# EAGLE design vcfvca (EAGLE 9.5.2)
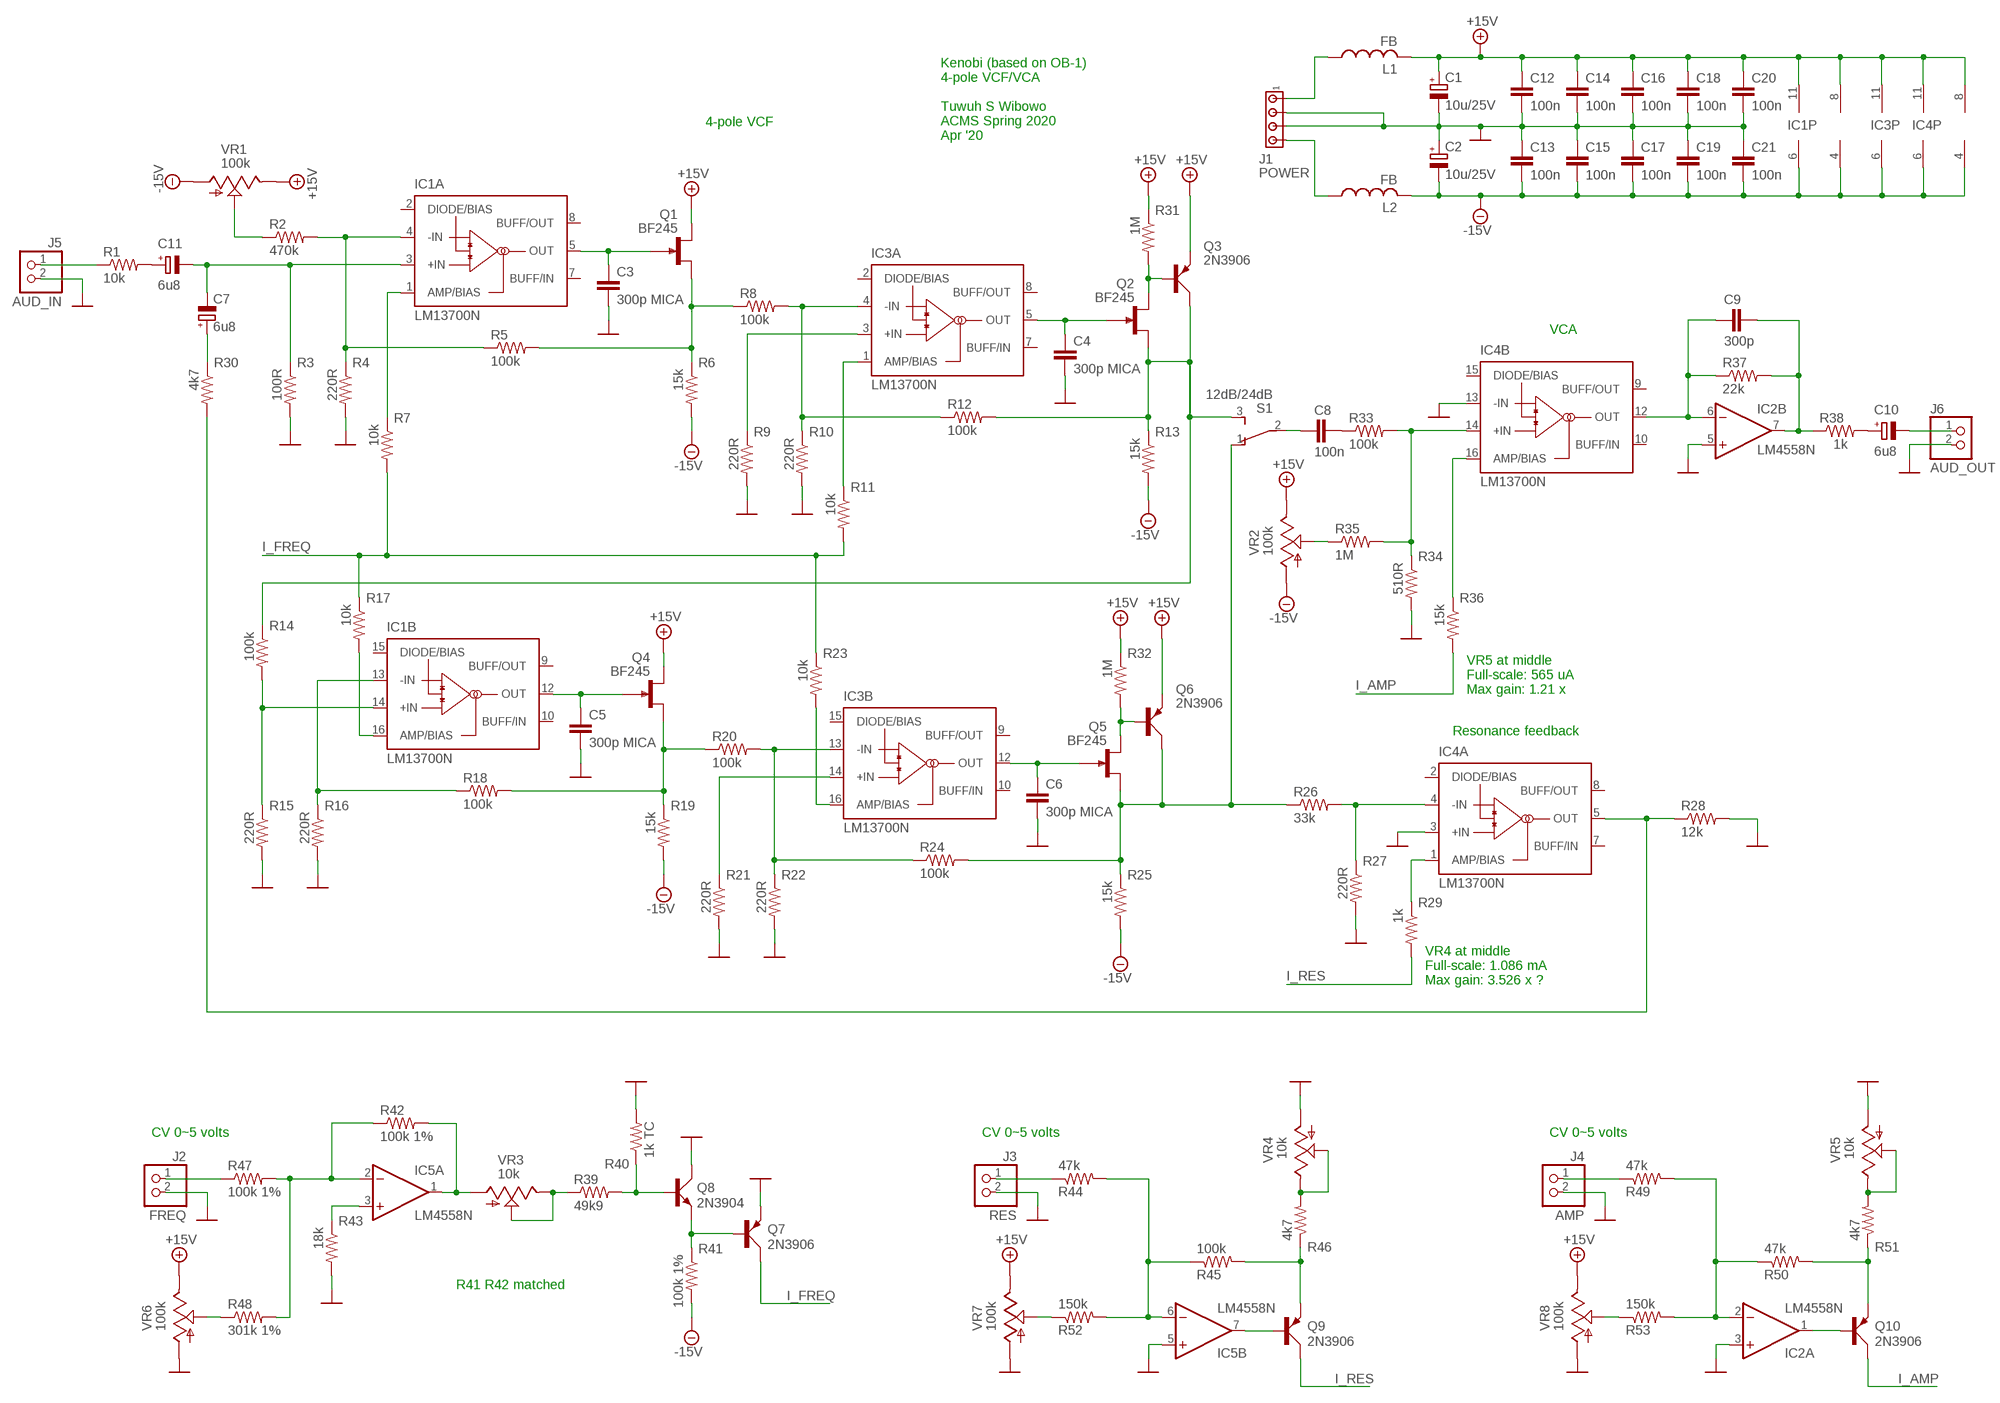
[diagram p0: schematic, sheet 1]

## Parts
C1  10u/25V  CPOL-EUE1.8-4  [E1,8-4]
C2  10u/25V  CPOL-EUE1.8-4  [E1,8-4]
C3  300p MICA  C-EU050-025X075  [C050-025X075]
C4  300p MICA  C-EU050-025X075  [C050-025X075]
C5  300p MICA  C-EU050-025X075  [C050-025X075]
C6  300p MICA  C-EU050-025X075  [C050-025X075]
C7  6u8  CPOL-EUE1.8-4  [E1,8-4]
C8  100n  C-EU050-025X075  [C050-025X075]
C9  300p  C-EU050-025X075  [C050-025X075]
C10  6u8  CPOL-EUE1.8-4  [E1,8-4]
C11  6u8  CPOL-EUE1.8-4  [E1,8-4]
C12  100n  C-EU050-025X075  [C050-025X075]
C13  100n  C-EU050-025X075  [C050-025X075]
C14  100n  C-EU050-025X075  [C050-025X075]
C15  100n  C-EU050-025X075  [C050-025X075]
C16  100n  C-EU050-025X075  [C050-025X075]
C17  100n  C-EU050-025X075  [C050-025X075]
C18  100n  C-EU050-025X075  [C050-025X075]
C19  100n  C-EU050-025X075  [C050-025X075]
C20  100n  C-EU050-025X075  [C050-025X075]
C21  100n  C-EU050-025X075  [C050-025X075]
IC1  LM13700N  LM13600N  [DIL16]
IC2  LM4558N  [DIL08]
IC3  LM13700N  LM13600N  [DIL16]
IC4  LM13700N  LM13600N  [DIL16]
IC5  LM4558N  [DIL08]
J1  POWER  MTA04-156  [1X4MTA]
J2  FREQ  PINHD-1X2  [1X02]
J3  RES  PINHD-1X2  [1X02]
J4  AMP  PINHD-1X2  [1X02]
J5  AUD_IN  PINHD-1X2  [1X02]
J6  AUD_OUT  PINHD-1X2  [1X02]
L1  FB  L-US0207/10  [0207/10]
L2  FB  L-US0207/10  [0207/10]
Q1  BF245  [SOT54C]
Q2  BF245  [SOT54C]
Q3  2N3906  [TO92D]
Q4  BF245  [SOT54C]
Q5  BF245  [SOT54C]
Q6  2N3906  [TO92D]
Q7  2N3906  [TO92D]
Q8  2N3904  [TO92D]
Q9  2N3906  [TO92D]
Q10  2N3906  [TO92D]
R1  10k  R-US_0207/10  [0207/10]
R2  470k  R-US_0207/10  [0207/10]
R3  100R  R-US_0207/10  [0207/10]
R4  220R  R-US_0207/10  [0207/10]
R5  100k  R-US_0207/10  [0207/10]
R6  15k  R-US_0207/10  [0207/10]
R7  10k  R-US_0207/10  [0207/10]
R8  100k  R-US_0207/10  [0207/10]
R9  220R  R-US_0207/10  [0207/10]
R10  220R  R-US_0207/10  [0207/10]
R11  10k  R-US_0207/10  [0207/10]
R12  100k  R-US_0207/10  [0207/10]
R13  15k  R-US_0207/10  [0207/10]
R14  100k  R-US_0207/10  [0207/10]
R15  220R  R-US_0207/10  [0207/10]
R16  220R  R-US_0207/10  [0207/10]
R17  10k  R-US_0207/10  [0207/10]
R18  100k  R-US_0207/10  [0207/10]
R19  15k  R-US_0207/10  [0207/10]
R20  100k  R-US_0207/10  [0207/10]
R21  220R  R-US_0207/10  [0207/10]
R22  220R  R-US_0207/10  [0207/10]
R23  10k  R-US_0207/10  [0207/10]
R24  100k  R-US_0207/10  [0207/10]
R25  15k  R-US_0207/10  [0207/10]
R26  33k  R-US_0207/10  [0207/10]
R27  220R  R-US_0207/10  [0207/10]
R28  12k  R-US_0207/10  [0207/10]
R29  1k  R-US_0207/10  [0207/10]
R30  4k7  R-US_0207/10  [0207/10]
R31  1M  R-US_0207/10  [0207/10]
R32  1M  R-US_0207/10  [0207/10]
R33  100k  R-US_0207/10  [0207/10]
R34  510R  R-US_0207/10  [0207/10]
R35  1M  R-US_0207/10  [0207/10]
R36  15k  R-US_0207/10  [0207/10]
R37  22k  R-US_0207/10  [0207/10]
R38  1k  R-US_0207/10  [0207/10]
R39  49k9  R-US_0207/10  [0207/10]
R40  1k TC  R-US_0207/10  [0207/10]
R41  100k 1%  R-US_0207/10  [0207/10]
R42  100k 1%  R-US_0207/10  [0207/10]
R43  18k  R-US_0207/10  [0207/10]
R44  47k  R-US_0207/10  [0207/10]
R45  100k  R-US_0207/10  [0207/10]
R46  4k7  R-US_0207/10  [0207/10]
R47  100k 1%  R-US_0207/10  [0207/10]
R48  301k 1%  R-US_0207/10  [0207/10]
R49  47k  R-US_0207/10  [0207/10]
R50  47k  R-US_0207/10  [0207/10]
R51  4k7  R-US_0207/10  [0207/10]
R52  150k  R-US_0207/10  [0207/10]
R53  150k  R-US_0207/10  [0207/10]
S1  12dB/24dB  TL36PO  [TL3XPO]
VR1  100k  TRIM_US-S63P  [S63P]
VR2  100k  TRIM_US-S63P  [S63P]
VR3  10k  TRIM_US-S63P  [S63P]
VR4  10k  TRIM_US-S63P  [S63P]
VR5  10k  TRIM_US-S63P  [S63P]
VR6  100k  TRIM_US-B64Y  [B64Y]
VR7  100k  TRIM_US-B64Y  [B64Y]
VR8  100k  TRIM_US-B64Y  [B64Y]

## Nets
+15V: C1.+ C12.1 C14.1 C16.1 C18.1 C20.1 IC1.11(P:V+) IC2.8(P:V+) IC3.11(P:V+) IC4.11(P:V+) IC5.8(P:V+) L1.2 Q1.D Q3.E Q4.D Q6.E R31.1 R32.1 VR1.E VR2.E VR6.E VR7.E VR8.E
-15V: C2.- C13.2 C15.2 C17.2 C19.2 C21.2 IC1.6(P:V-) IC2.4(P:V-) IC3.6(P:V-) IC4.6(P:V-) IC5.4(P:V-) L2.2 R6.2 R13.2 R19.2 R25.2 R41.2 VR1.A VR2.A
GND: C1.- C2.+ C3.2 C4.2 C5.2 C6.2 C12.2 C13.1 C14.2 C15.1 C16.2 C17.1 C18.2 C19.1 C20.2 C21.1 IC2.3(A:+IN) IC2.5(B:+IN) IC4.3(A:+IN) IC4.13(B:-IN) IC5.5(B:+IN) J1.2 J1.3 J2.2 J3.2 J4.2 J5.2 J6.2 Q7.E Q8.C R3.2 R4.2 R9.2 R10.2 R15.2 R16.2 R21.2 R22.2 R27.2 R28.2 R34.2 R40.2 R43.2 VR4.A VR5.A VR6.A VR7.A VR8.A
I_AMP: Q10.C R36.2
I_FREQ: Q7.C R7.2 R11.2 R17.1 R23.1
I_RES: Q9.C R29.2
N$2: C4.1 IC3.5(A:OUT) Q2.G
N$3: C3.1 IC1.5(A:OUT) Q1.G
N$4: C5.1 IC1.12(B:OUT) Q4.G
N$5: C6.1 IC3.12(B:OUT) Q5.G
N$6: IC1.4(A:-IN) R2.2 R4.1 R5.1
N$7: IC1.1(A:AMP/BIAS) R7.1
N$8: Q1.S R5.2 R6.1 R8.1
N$9: C7.- C11.- IC1.3(A:+IN) R3.1
N$10: IC3.1(A:AMP/BIAS) R11.1
N$11: IC3.3(A:+IN) R9.1
N$12: IC3.4(A:-IN) R8.2 R10.1 R12.1
N$13: C7.+ R30.1
N$14: IC1.14(B:+IN) R14.2 R15.1
N$15: IC1.13(B:-IN) R16.1 R18.1
N$16: IC4.4(A:-IN) R26.2 R27.1
N$17: Q4.S R18.2 R19.1 R20.1
N$18: Q2.S Q3.C R12.2 R13.1 R14.1 S1.3(S)
N$19: Q5.S Q6.C R24.2 R25.1 R26.1 S1.1(O)
N$20: IC3.13(B:-IN) R20.2 R22.1 R24.1
N$21: IC3.14(B:+IN) R21.1
N$22: IC4.1(A:AMP/BIAS) R29.1
N$23: IC1.16(B:AMP/BIAS) R17.2
N$24: IC3.16(B:AMP/BIAS) R23.2
N$25: IC4.5(A:OUT) R28.1 R30.2
N$26: Q5.D Q6.B R32.2
N$27: Q2.D Q3.B R31.2
N$28: C8.1 S1.2(P)
N$29: C8.2 R33.1
N$30: IC4.14(B:+IN) R33.2 R34.1 R35.2
N$31: C9.1 IC2.6(B:-IN) IC4.12(B:OUT) R37.1
N$32: R35.1 VR2.S
N$33: IC4.16(B:AMP/BIAS) R36.1
N$34: R2.1 VR1.S
N$35: C9.2 IC2.7(B:OUT) R37.2 R38.1
N$36: C10.+ R38.2
N$37: C11.+ R1.2
N$38: IC5.1(A:OUT) R42.2 VR3.A
N$39: R39.1 VR3.E VR3.S
N$40: Q8.B R39.2 R40.1
N$41: IC5.3(A:+IN) R43.1
N$42: IC5.2(A:-IN) R42.1 R47.2 R48.2
N$43: Q7.B Q8.E R41.1
N$44: R46.2 VR4.E VR4.S
N$45: R51.2 VR5.E VR5.S
N$46: Q9.E R45.2 R46.1
N$47: IC5.7(B:OUT) Q9.B
N$48: IC5.6(B:-IN) R44.2 R45.1 R52.2
N$49: Q10.E R50.2 R51.1
N$50: IC2.1(A:OUT) Q10.B
N$51: J2.1 R47.1
N$52: IC2.2(A:-IN) R49.2 R50.1 R53.2
N$53: J4.1 R49.1
N$54: R48.1 VR6.S
N$55: J5.1 R1.1
N$56: J3.1 R44.1
N$57: C10.- J6.1
N$58: R52.1 VR7.S
N$60: R53.1 VR8.S
N$63: J1.1 L1.1
N$64: J1.4 L2.1
Unconnected: IC1.2(A:DIODE/BIAS) IC1.7(A:BUFF/IN) IC1.8(A:BUFF/OUT) IC1.9(B:BUFF/OUT) IC1.10(B:BUFF/IN) IC1.15(B:DIODE/BIAS) IC3.2(A:DIODE/BIAS) IC3.7(A:BUFF/IN) IC3.8(A:BUFF/OUT) IC3.9(B:BUFF/OUT) IC3.10(B:BUFF/IN) IC3.15(B:DIODE/BIAS) IC4.2(A:DIODE/BIAS) IC4.7(A:BUFF/IN) IC4.8(A:BUFF/OUT) IC4.9(B:BUFF/OUT) IC4.10(B:BUFF/IN) IC4.15(B:DIODE/BIAS)

## Notes on the sheet
- 4-pole VCF
- Kenobi (based on OB-1)
  4-pole VCF/VCA
  
  Tuwuh S Wibowo
  ACMS Spring 2020
  Apr '20
- VCA
- VR5 at middle
  Full-scale: 565 uA
  Max gain: 1.21 x
- Resonance feedback
- VR4 at middle
  Full-scale: 1.086 mA
  Max gain: 3.526 x ?
- CV 0~5 volts | CV 0~5 volts | CV 0~5 volts
- R41 R42 matched

## Library data of the parts
C1 C2 C7 C10 C11 = rcl:CPOL-EU: POLARIZED CAPACITOR, European symbol; SPICEPREFIX: C
C3-C6 C8 C9 C12-C21 = rcl:C-EU: CAPACITOR, European symbol; SPICEPREFIX: C
IC1 IC3 IC4 = national-semiconductor:LM13600: Dual Operational Transconductance Amplifiers with Linearizing Diodes and Buffers Source: lm13600.PDF
IC2 IC5 = linear:*4558: OP AMP
J1 = con-amp:MTA04-156: AMP connector
J2-J6 = pinhead:PINHD-1X2: PIN HEADER
L1 L2 = rcl:L-US: INDUCTOR, American symbol; SPICEPREFIX: L
Q1 Q2 Q4 Q5 = transistor-small-signal:BF245: N-CHANNEL FET http://www.onsemi.com/pub/Collateral/BF245A-D.PDF
Q3 Q6 Q7 Q9 Q10 = transistor-small-signal:2N3906: PNP TRANSISTOR
Q8 = transistor-small-signal:2N3904: NPN TRANSISTOR
R1-R53 = rcl:R-US_: RESISTOR, American symbol; SPICEPREFIX: R
S1 = switch:TL36PO: TINY SWITCH ON - ON Source: http://www2.produktinfo.conrad.com/datenblaetter/700000-724999/705152-da-01-de-Subminiaturschalter_TL_36YO.pdf
VR1-VR8 = pot:TRIM_US-: POTENTIOMETER

## Board
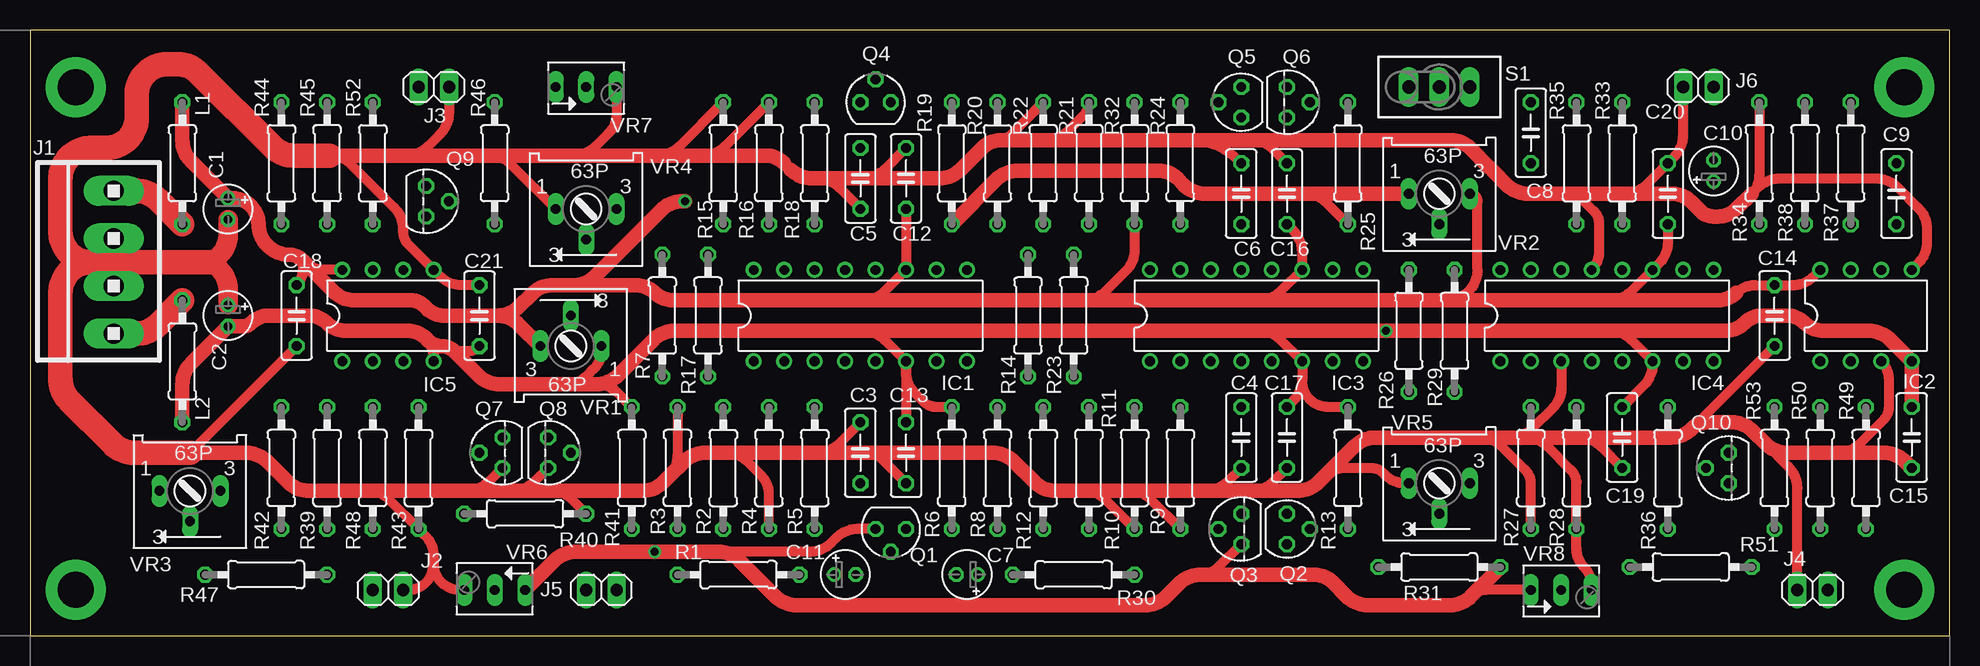
[diagram p1: board, top side]
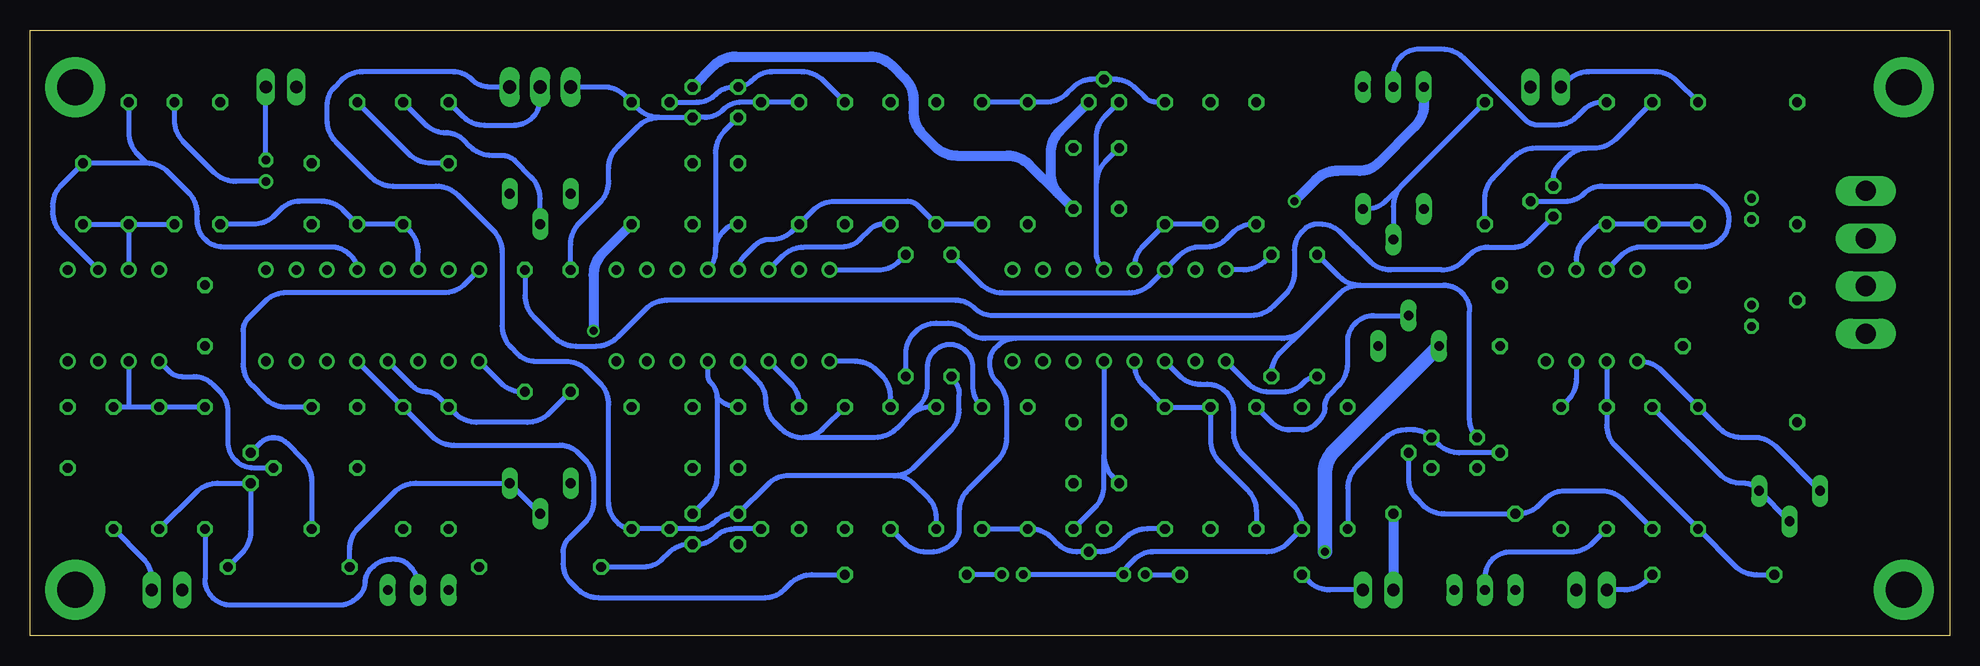
[diagram p2: board, bottom side, seen from below]

Size 160 x 50.47 mm. Coordinates in mm from the lower left corner, seen from the top.
Outline: 0,0 160,0 160,50.47 0,50.47 0,0
Copper layers (1*16): Top 0.035mm / dielectric 1.5mm / Bottom 0.035mm
Design rules "default": minimum track width 6mil, minimum drill 0.35mm, track to track 6mil, track to pad 6mil, pad to pad 6mil, via to via 6mil, smd to smd 6mil, copper to edge 40mil, drill to drill 6mil, minimum pad ring 10mil, minimum via ring 8mil, stop-mask expansion 4mil, vias tented up to drill 0mil, thermal gap 10mil

### Footprints (pad centres in the part's own frame; a part is rotated, then mirrored left to right if it is on the bottom)
E1,8-4 = drill 0.711 pad 1.168: + -0.889,0 | drill 0.711 pad 1.168 octagon: - 0.889,0
C050-025X075 = drill 0.813 octagon: 1 -2.54,0; 2 2.54,0
DIL16 = drill 0.813 pad 1.27: 1 -8.89,-3.81; 2 -6.35,-3.81; 3 -3.81,-3.81; 4 -1.27,-3.81; 5 1.27,-3.81; 6 3.81,-3.81; 7 6.35,-3.81; 8 8.89,-3.81; 9 8.89,3.81; 10 6.35,3.81; 11 3.81,3.81; 12 1.27,3.81; 13 -1.27,3.81; 14 -3.81,3.81; 15 -6.35,3.81; 16 -8.89,3.81
DIL08 = drill 0.813 pad 1.27: 1 -3.81,-3.81; 2 -1.27,-3.81; 3 1.27,-3.81; 4 3.81,-3.81; 5 3.81,3.81; 6 1.27,3.81; 7 -1.27,3.81; 8 -3.81,3.81
1X4MTA = drill 1.676 long: 1 5.944,0; 2 1.981,0; 3 -1.981,0; 4 -5.944,0
1X02 = drill 1.016 long: 1 -1.27,0; 2 1.27,0
0207/10 = drill 0.813 octagon: 1 -5.08,0; 2 5.08,0
SOT54C = drill 0.813 octagon: D 1.27,0; G -1.27,0; S 0,1.905
TO92D = drill 0.813 octagon: B 0,1.905; C 1.27,0; E -1.27,0
TL3XPO = drill 1.1 pad 1.422 long: 1 -2.54,0; 2 0,0; 3 2.54,0
S63P = drill 0.813 long: A 2.54,0; E -2.54,0; S 0,2.54
B64Y = drill 0.813 long: A 2.54,0; E -2.54,0; S 0,0

### Placement (x,y rotation side)
C1  16.51,35.56 270 top
C2  16.51,26.67 270 top
C3  69.22,15.24 90 top
C4  100.97,16.51 270 top
C5  69.22,38.1 270 top
C6  100.97,36.83 90 top
C7  78.11,5.08 180 top
C8  125.09,41.91 270 top
C9  155.57,36.83 270 top
C10  140.34,38.73 90 top
C11  67.94,5.08 0 top
C12  73.03,38.1 90 top
C13  73.03,15.24 90 top
C14  145.41,26.67 270 top
C15  156.84,16.51 90 top
C16  104.78,36.83 90 top
C17  104.78,16.51 90 top
C18  22.23,26.67 270 top
C19  132.72,16.51 90 top
C20  136.53,36.83 90 top
C21  37.47,26.67 270 top
IC1  69.22,26.67 0 top
IC2  153.03,26.67 0 top
IC3  102.23,26.67 0 top
IC4  131.44,26.67 0 top
IC5  29.84,26.67 0 top
J1  6.99,31.11 90 top
J2  29.84,3.81 0 top
J3  33.66,45.72 0 top
J4  148.59,3.81 180 top
J5  47.62,3.81 180 top
J6  139.06,45.72 180 top
L1  12.7,39.37 90 top
L2  12.7,22.86 270 top
Q1  71.75,8.89 180 top
Q2  104.78,8.89 270 top
Q3  100.97,8.89 90 top
Q4  70.48,44.45 0 top
Q5  100.97,44.45 90 top
Q6  104.78,44.45 270 top
Q7  39.37,15.24 90 top
Q8  43.18,15.24 270 top
Q9  33.02,36.2 270 top
Q10  141.6,13.97 90 top
R1  59.05,5.08 0 top
R2  57.78,13.97 270 top
R3  53.98,13.97 90 top
R4  61.59,13.97 270 top
R5  65.41,13.97 270 top
R6  76.83,13.97 90 top
R7  52.7,26.67 90 top
R8  80.64,13.97 90 top
R9  95.89,13.97 270 top
R10  92.08,13.97 270 top
R11  88.27,13.97 270 top
R12  84.45,13.97 270 top
R13  109.86,13.97 90 top
R14  83.19,26.67 90 top
R15  57.78,39.37 90 top
R16  61.59,39.37 90 top
R17  56.52,26.67 90 top
R18  65.41,39.37 90 top
R19  76.83,39.37 270 top
R20  80.64,39.37 270 top
R21  88.27,39.37 90 top
R22  84.45,39.37 90 top
R23  87,26.67 90 top
R24  95.89,39.37 90 top
R25  109.86,39.37 270 top
R26  114.94,25.4 270 top
R27  125.09,13.97 270 top
R28  128.91,13.97 270 top
R29  118.75,25.4 90 top
R30  87,5.08 0 top
R31  117.47,5.71 180 top
R32  92.08,39.37 90 top
R33  132.72,39.37 270 top
R34  144.15,39.37 90 top
R35  128.91,39.37 270 top
R36  136.53,13.97 270 top
R37  151.76,39.37 270 top
R38  147.96,39.37 90 top
R39  24.77,13.97 270 top
R40  41.27,10.16 0 top
R41  50.16,13.97 90 top
R42  20.95,13.97 90 top
R43  32.38,13.97 270 top
R44  20.95,39.37 270 top
R45  24.77,39.37 90 top
R46  38.73,39.37 90 top
R47  19.68,5.08 180 top
R48  28.57,13.97 90 top
R49  153.03,13.97 90 top
R50  149.22,13.97 270 top
R51  138.43,5.71 180 top
R52  28.57,39.37 270 top
R53  145.41,13.97 90 top
S1  117.47,45.72 0 top
VR1  45.09,24.13 0 top
VR2  117.47,36.83 180 top
VR3  13.34,12.06 180 top
VR4  46.35,35.56 180 top
VR5  117.47,12.7 180 top
VR6  38.73,3.81 180 top
VR7  46.35,45.72 0 top
VR8  127.64,3.81 0 top

### Tracks (layer width: path | path; a pad name or v marks a point on that pad's centre or on a via)
+15V  (via drill 0.65)
  Top 0.813: 69.43,27.94 arc45 71.23,28.68 IC1.11 C12.1 | 102.45,27.94 arc45 104.25,28.68 IC3.11 106.05,31.97 arc45 105.3,33.76 C16.1 | 131.66,27.94 arc45 133.46,28.68 IC4.11 135.78,31.01 arc45 136.53,32.8 C20.1 | R32.1 92.08,32.17 arc-45 91.33,30.37 89.64,28.68 arc-45 87.85,27.94 | 118.11,27.94 arc90 120.65,30.48 120.65,36.2 arc90 VR2.E | 40.75,25.93 arc45 38.95,26.67 | 142.24,28.57 arc-45 143.77,29.21 C14.1 146.9,29.21 arc45 148.7,29.95 IC2.8 | Q1.D 69,8.89 arc45 67.2,8.15 66.78,7.73 arc-45 64.99,6.99 57.37,6.99 | IC5.8 24.55,30.48 arc-45 22.75,31.22 22.75,30.48 arc-45 C18.1 | Q3.E 99.03,5.68 arc-45 97.57,5.08 | VR8.E 121.39,3.81 arc45 120.12,3.28
  Top 1.219: 38.95,26.67 34.55,26.67 arc-45 33.02,27.3 32.83,27.49 arc45 31.75,27.94 27.09,27.94 arc-45 25.29,28.68 22.75,31.22 22.67,31.3 arc45 21.59,31.75 arc-90 19.05,34.29 arc90 16.89,36.45 C1.+ 13.44,39.52 arc-45 12.7,41.31 L1.2 | 38.95,26.67 arc45 40.75,27.41 41.8,28.47 arc-45 43.6,29.21 45.3,29.21 | 142.24,28.57 arc-45 140.71,27.94 131.66,27.94 118.11,27.94 102.45,27.94 87.85,27.94 69.43,27.94 53.6,27.94 arc-45 52.07,28.57 arc45 50.54,29.21 45.3,29.21 | v54.61,36.2 54.39,36.2 arc45 52.6,35.45 47.1,29.95 arc-45 45.3,29.21 | 38.95,26.67 arc-45 40.75,25.93 VR1.E | VR6.E 43.71,6.24 arc-45 45.5,6.99 v52.07,6.99 57.37,6.99 arc-45 59.16,6.24 62.12,3.28 arc45 63.92,2.54 92.93,2.54 arc45 94.72,3.28 95.78,4.34 arc-45 97.57,5.08 107.05,5.08 arc-45 108.58,4.45 109.75,3.28 arc45 111.54,2.54 118.33,2.54 arc45 120.12,3.28 R31.1
  Bottom 0.813: VR7.E 43.81,44.23 arc45 44.56,42.44 47.62,39.37 arc45 49.16,38.73 51.02,38.73 arc-45 52.81,37.99 v54.61,36.2 | Q4.D 74.19,42.02 arc-45 74.93,40.22 74.93,38.52 arc-45 74.19,36.72 | C12.1 74.19,36.72 | 74.19,36.72 76.73,39.26 arc-45 78.52,40.01 82.77,40.01 arc45 84.56,40.75 85.62,41.8 arc45 86.36,43.6 86.36,44.67 arc-45 87.1,46.46 88.16,47.52 arc-45 89.95,48.26 101.18,48.26 arc-45 102.98,47.52 Q6.E | 51.33,15.35 arc-45 52.07,13.55
  Bottom 1.219: VR1.E 51.33,15.35 arc-45 52.07,13.55 v52.07,6.99
-15V  (via drill 0.65)
  Top 0.813: 141.34,25.4 arc45 142.88,26.04 arc-45 144.41,26.67 | 146.42,26.67 arc-45 147.96,26.04 arc45 149.49,25.4 | IC1.6 71.23,24.66 arc45 69.43,25.4 | 102.45,25.4 arc-45 104.25,24.66 IC3.6 106.05,21.37 | 106.05,21.37 arc-45 105.3,19.58 C17.2 | IC1.6 C13.2 | 131.66,25.4 arc-45 133.46,24.66 IC4.6 135.25,22.64 arc-45 134.51,20.85 C19.2 | 155.05,24.66 arc45 153.25,25.4 | 80.54,37.99 arc-45 82.33,38.73 | 106.26,36.83 arc-45 108.06,36.09 R25.2 | R6.2 75.56,19.05 arc-45 74.48,19.5 73.77,20.21 arc-45 73.03,22.01 IC1.6 | R13.2 108.21,19.05 arc-45 106.68,19.68 arc-45 106.05,21.22 106.05,21.37 | R41.2 49,20.21 arc45 47.21,20.95 | IC5.4 33.66,23.23 arc45 33.02,24.77 | VR1.A 47.62,23.76 arc-45 46.99,22.23 46.46,21.7 arc-45 44.67,20.95 43.18,20.95 | C21.2 arc-45 36.38,23.68 35.37,23.68
  Top 1.219: R19.2 80.54,37.99 arc-45 82.33,38.73 94.1,38.73 arc-45 95.63,38.1 96.16,37.57 arc45 97.95,36.83 106.26,36.83 VR2.A | C15.2 IC2.4 155.05,24.66 arc45 153.25,25.4 149.49,25.4 arc-45 147.96,26.04 arc45 146.42,26.67 144.41,26.67 arc45 142.88,26.04 arc-45 141.34,25.4 131.66,25.4 v113.03,25.4 102.45,25.4 69.43,25.4 53.76,25.4 arc45 51.96,24.66 49,21.7 arc-45 47.21,20.95 43.18,20.95 39.15,20.95 arc-45 37.36,21.7 35.37,23.68 arc45 34.29,24.13 arc-45 33.21,24.58 33.02,24.77 arc45 31.49,25.4 26.3,25.4 arc-45 24.77,26.04 arc45 23.23,26.67 19.95,26.67 arc45 18.41,26.04 arc-45 17.8,25.78 C2.- 13.44,22.71 arc45 12.7,20.92 L2.2
  Bottom 0.813: R25.2 112.29,31.86 arc-45 113.03,30.06 v113.03,25.4
GND
  Top 0.813: 54.5,14.5 arc-45 56.3,15.24 | 69.85,15.24 arc-45 70.93,14.79 C13.1 | C3.2 67.42,15.98 arc-45 65.62,15.24 | R3.2 53.98,15.02 arc-45 53.23,13.23 | R4.2 61.59,11.8 arc45 60.96,13.34 59.8,14.5 arc45 58,15.24 | 138.54,17.25 arc-45 136.74,16.51 | 138.54,17.25 C14.2 | C19.1 130.92,15.77 arc45 129.12,16.51 | R27.2 125.09,12.7 arc45 124.65,13.78 122.66,15.77 arc45 120.87,16.51 | IC4.3 127.64,20.58 arc-45 127,19.05 125.2,17.25 arc-45 123.41,16.51 124.68,16.51 arc-45 126.47,15.77 128.46,13.78 arc-45 128.91,12.7 R28.2 128.91,7.25 arc45 129.54,5.71 arc-45 130.18,4.18 VR8.A | 139.81,17.78 arc45 138.54,17.25 | 141.6,17.78 141.82,17.78 arc-45 143.62,17.04 | 146.47,15.24 arc-45 144.67,15.98 146.58,14.08 arc-45 147.32,12.28 J4.2 | IC2.3 arc-45 154.94,21.33 154.94,19.05 arc-45 154.49,17.97 152.51,15.98 arc-45 150.71,15.24 | C5.2 67.42,37.36 arc45 65.62,38.1 65.19,38.1 arc-45 63.39,38.84 62.87,39.37 arc45 61.33,40.01 | C12.2 71.23,38.84 arc-45 69.43,38.1 | C6.2 100.7,39.63 arc45 96.74,41.27 | 120.02,40.64 arc45 118.48,41.27 | 121.6,39.05 121.92,38.73 | 123.08,37.57 arc45 124.88,36.83 | VR7.A 48.9,43.44 arc-45 48.26,41.91 47.1,40.75 arc-45 45.3,40.01 | R15.2 54.08,40.75 arc-45 52.29,40.01 | R16.2 57.89,40.75 arc-45 56.1,40.01 | C21.1 35.98,29.21 arc-45 34.18,29.95 IC5.5 31.56,32.57 arc-45 31.11,33.66 31.11,33.87 arc45 30.37,35.67 26.78,39.26 arc45 24.98,40.01 | 132.93,36.83 arc45 134.73,37.57 C20.2 137.05,39.9 arc45 137.79,41.69 J6.2 | IC4.13 arc45 130.81,32.01 130.81,34.29 arc45 130.36,35.37 129.65,36.09 arc45 127.85,36.83 | 52.81,12.81 arc-45 51.02,12.06 | R40.2 45.19,11.32 arc45 43.4,12.06
  Top 0.813: Q8.C 42.02,12.81 arc-45 40.22,12.06 | Q7.E 38.21,12.81 arc-45 36.41,12.06 | J2.2 31.49,3.81 arc45 33.02,4.45 arc45 33.66,5.98 | VR6.A 35.82,3.81 arc-45 34.29,4.45 arc-45 33.66,5.98 | 23.28,12.06 arc-45 21.48,12.81 | VR4.A 40.11,39.26 arc45 38.32,40.01 | 31.33,40.01 arc45 33.13,40.75 34.18,41.8 arc45 34.92,43.6 J3.2 | C16.2 103.61,40.53 arc45 101.82,41.27 | 33.66,5.98 33.66,6.57 arc45 32.91,8.36 R43.2 29.95,11.32 arc45 28.16,12.06 | R21.2 arc-45 87.82,43.37 86.47,42.02 arc-45 84.67,41.27 83.19,41.27 | R22.2 83.71,43.71 | 83.71,43.71 arc-45 83.71,43.71 | 80.91,41.27 arc45 81.54,41.54 83.71,43.71 | C18.2 13.34,15.24 | R10.2 89.64,11.32 arc45 87.85,12.06 85.51,12.06 | R9.2 93.45,11.32 arc45 91.66,12.06 89.53,12.06 | C4.2 99.8,12.81 arc-45 98.01,12.06 93.34,12.06 | C17.1 103.61,12.81 arc-45 101.82,12.06 99.06,12.06 | VR5.A 114.56,12.7 arc-45 113.03,13.34 112.84,13.52 arc45 111.76,13.97 109.64,13.97 arc45 107.84,13.23 107.42,12.81 | R34.2 144.15,38.36 arc-45 143.51,36.83 144.04,37.36 arc-45 145.83,38.1 153.89,38.1 arc-45 155.68,37.36 157.37,35.67 arc-45 158.12,33.87 158.12,32.8 arc-45 157.37,31.01 IC2.5
  Top 1.219: 24.98,40.01 31.33,40.01 38.32,40.01 45.3,40.01 52.29,40.01 56.1,40.01 61.33,40.01 arc-45 62.87,39.37 | 63.39,38.84 arc45 65.19,38.1 69.43,38.1 75.78,38.1 arc45 77.58,38.84 79.38,40.64 arc-45 80.91,41.27 83.19,41.27 96.74,41.27 101.82,41.27 118.48,41.27 arc-45 120.02,40.64 121.6,39.05 | 121.92,38.73 123.08,37.57 arc45 124.88,36.83 127.85,36.83 132.93,36.83 136.9,36.83 arc-45 138.43,36.2 139.25,35.37 arc45 140.34,34.92 140.71,34.92 arc45 142.24,35.56 143.51,36.83 | 141.6,17.78 139.81,17.78 arc45 138.54,17.25 arc-45 136.74,16.51 129.12,16.51 123.41,16.51 120.87,16.51 112.18,16.51 arc45 110.38,15.77 107.42,12.81 arc-45 105.63,12.06 99.06,12.06 93.34,12.06 89.53,12.06 85.51,12.06 arc-45 83.71,12.81 82.02,14.5 arc45 80.23,15.24 69.85,15.24 65.62,15.24 58,15.24 56.3,15.24 arc45 54.5,14.5 53.23,13.23 52.81,12.81 arc-45 51.02,12.06 43.4,12.06 40.22,12.06 36.41,12.06 28.16,12.06 23.28,12.06 arc-45 21.48,12.81 19.79,14.5 arc45 18,15.24 13.34,15.24 | 141.82,17.78 arc-45 143.62,17.04 144.67,15.98 arc45 146.47,15.24 150.71,15.24 154.52,15.24 arc-45 156.32,14.5 C15.1
  Top 1.626: C1.- 16.51,33.44 arc-45 15.77,31.64 15.24,31.11 15.77,30.59 arc-45 16.51,28.79 C2.+
  Top 2.032: J1.2 6.99,31.11 | 6.99,31.11 J1.3 | 15.24,31.11 6.99,31.11 | 5.08,31.11 arc-90 2.54,33.66 2.54,38.1 arc-90 5.08,40.64 6.35,40.64 arc90 8.89,43.18 8.89,45.09 arc-90 11.43,47.62 12.28,47.62 arc-45 14.08,46.88 20.21,40.75 arc45 22.01,40.01 24.98,40.01 | 6.99,31.11 5.08,31.11 | 5.08,31.11 arc90 2.54,28.57 2.54,21.37 arc45 3.28,19.58 6.88,15.98 arc45 8.67,15.24 13.34,15.24
  Bottom 0.813: R40.2 J5.2
I_AMP
  Bottom 0.406: Q10.C 140.78,16.06 arc45 139.7,16.51 arc45 138.62,16.06 137.27,14.71 arc45 136.53,12.92 R36.2
I_FREQ
  Bottom 0.406: 53.87,25.51 arc45 55.66,24.77 77.84,24.77 | R17.1 56.52,21.81 arc45 55.77,23.6 53.87,25.51 | Q7.C arc45 40.01,18.04 40.01,27.04 arc-45 40.64,28.57 arc-45 42.17,29.21 49.11,29.21 | R7.2 50.91,29.95 arc-45 49.11,29.21 | 53.87,25.51 50.91,28.47 arc45 49.11,29.21 | 77.84,24.77 arc-45 79.38,24.13 79.56,23.94 arc-45 80.01,22.86 80.01,22.61 arc-45 79.38,21.08 79.36,21.06 arc45 78.61,19.27 78.61,16.42 arc45 79.36,14.62 81.81,12.17 arc-45 82.55,10.38 82.55,8.89 arc45 83,7.81 83.08,7.73 arc45 84.87,6.99 85.31,6.99 arc45 87.1,7.73 R11.2 | 77.84,24.77 80.38,24.77 arc45 81.92,25.4 arc-45 83.45,26.04 84.45,26.04 arc-90 87,23.5 R23.1
I_RES
  Bottom 0.406: Q9.C 35.11,32.83 arc45 36.2,32.38 38.47,32.38 arc-45 40.01,31.75 40.53,31.22 arc45 42.33,30.48 46.57,30.48 arc45 48.37,31.22 50.69,33.55 arc-45 52.49,34.29 52.7,34.29 arc-45 53.79,33.84 53.98,33.66 arc-45 54.61,32.12 54.61,30.26 arc45 55.35,28.47 56.41,27.41 arc45 58.2,26.67 79.75,26.67 arc45 81.28,27.3 arc-45 82.81,27.94 106.9,27.94 arc-45 108.69,27.2 111.02,24.87 arc45 112.81,24.13 114.52,24.13 arc45 116.31,24.87 118,26.56 arc45 118.75,28.36 R29.2
N$1  (via drill 3 pad 5)
  other vias: 3.81,45.72
N$2
  Bottom 0.406: Q2.G 103.49,11.45 arc-45 102.74,13.24 102.74,19.86 | IC3.5 103.5,21.7 arc-45 103.25,21.08 arc45 102.74,19.86 | C4.1 arc45 102.62,19.74 102.74,19.86
N$3
  Bottom 0.406: IC1.5 70.48,15.02 | 70.48,15.02 arc-45 69.74,13.23 C3.1 | Q1.G 71.23,10.69 arc-45 70.48,12.48 70.48,15.02
N$4
  Bottom 0.406: IC1.12 arc45 71.12,32.01 71.12,37.68 | Q4.G 70.38,43.29 arc-45 71.12,41.49 71.12,37.68 | C5.1 70.38,39.48 arc-45 71.12,37.68
N$5
  Bottom 0.406: Q5.G 102.13,42.02 arc-45 102.87,40.22 102.87,32.12 | IC3.12 arc-45 102.87,32.01 102.87,32.12 | C6.1 arc-45 102.05,33.84 102.23,33.66 arc-45 102.87,32.12
N$6
  Bottom 0.406: IC1.4 67.94,22.64 arc-45 67.2,20.85 R5.1 R4.1 61.59,16.29 arc-45 60.85,14.5 58.53,12.17 arc45 57.78,10.38 R2.2
N$7
  Bottom 0.406: IC1.1 58.53,21.06 arc-45 56.73,20.32 55.51,20.32 arc-45 53.98,20.95 53.79,21.14 arc45 R7.1
N$8
  Bottom 0.406: R5.2 66.89,8.89 arc-45 68.69,8.15 69.22,7.62 arc45 70.75,6.99 Q1.S 72.76,6.99 arc45 74.3,7.62 74.82,8.15 arc-45 76.62,8.89 R6.1 R8.1
N$9
  Bottom 0.406: IC1.3 64.24,21.7 arc-45 62.45,20.95 61.86,20.95 arc45 60.33,20.32 arc45 59.69,18.79 59.69,16.93 arc-45 58.95,15.13 54.72,10.9 arc45 53.98,9.11 R3.1 55.14,7.73 arc45 56.93,6.99 66.41,6.99 arc-45 67.94,6.35 68.56,5.73 arc-45 C11.- C7.-
N$10
  Bottom 0.406: IC3.1 91.22,22.86 arc45 89.43,22.12 89.01,21.7 arc45 88.27,19.9 R11.1
N$11
  Bottom 0.406: IC3.3 96.63,21.06 arc45 95.89,19.27 R9.1
N$12
  Bottom 0.406: R8.2 80.66,19.07 arc45 81.41,20.86 81.41,22.35 arc-180 85.22,22.35 85.22,20.86 arc45 85.96,19.07 86.72,18.31 | IC3.4 99.4,21.29 arc45 98.68,19.56 arc-45 97.96,17.82 97.39,17.25 arc-45 95.59,16.51 | R10.1 93.92,17.2 arc45 95.59,16.51 | 95.59,16.51 89.57,16.51 arc-45 87.78,17.25 86.72,18.31 | 86.72,18.31 arc45 84.93,19.05 R12.1
N$13
  Bottom 0.406: C7.+ R30.1
N$14
  Bottom 0.406: R15.1 58,34.29 arc-45 59.8,33.55 60.33,33.02 arc45 61.86,32.38 62.45,32.38 arc-45 64.24,31.64 IC1.14 66.57,29.32 arc45 68.36,28.57 78.96,28.57 arc45 80.75,29.32 R14.2
N$15
  Bottom 0.406: R16.1 R18.1 67.2,32.49 arc-45 67.94,30.7 IC1.13
N$16
  Bottom 0.406: R26.2 116.73,18.52 arc45 118.53,17.78 122.77,17.78 arc45 124.57,18.52 R27.1 125.92,19.87 arc-45 127,20.32 arc45 128.08,20.77 IC4.4
N$17
  Bottom 0.406: R18.2 66.04,44.45 arc45 67.12,44.9 67.84,45.61 arc-45 69.63,46.35 Q4.S 71.49,46.35 arc-45 73.03,45.72 73.55,45.19 arc45 75.35,44.45 R19.1 R20.1
N$18
  Bottom 0.406: R13.1 104.4,8.89 arc-45 102.87,9.53 arc45 101.34,10.16 Q3.C 98.53,12.59 arc45 96.74,13.34 88.05,13.34 | S1.3 121.66,45.72 arc45 123.19,46.35 arc-45 124.72,46.99 132.3,46.99 arc-45 134.09,46.25 134.62,45.72 arc-45 135.25,44.19 135.25,42.96 arc-45 134.51,41.17 131.55,38.21 arc-45 129.76,37.47 126.15,37.47 arc45 124.35,36.72 121.39,33.76 arc45 120.65,31.97 120.65,25.82 arc-45 119.91,24.02 119.38,23.5 arc-45 117.85,22.86 115.35,22.86 arc45 113.56,22.12 112.5,21.06 arc45 111.76,19.27 111.76,11.06 arc-45 111.12,9.53 110.94,9.34 arc-45 R13.1 | Q2.S R13.1 | R14.1 arc45 82.55,20.06 82.55,18.83 arc45 83.29,17.04 86.25,14.08 arc45 88.05,13.34 | R12.2 84.45,9.9 arc-45 85.09,11.43 86.25,12.59 arc-45 88.05,13.34
N$19
  Bottom 0.406: R24.2 Q5.S 100.7,44.45 arc-45 102.23,43.81 arc45 103.77,43.18 Q6.C 107.53,43.18 | 107.53,43.18 arc45 109.33,43.92 R25.1 110.38,44.98 arc-45 112.18,45.72 S1.1 | 107.53,43.18 arc-45 109.33,42.44 111.02,40.75 arc-45 111.76,38.95 111.76,37.88 arc45 112.5,36.09 114.19,34.4 arc-45 114.94,32.6 R26.1
N$20
  Bottom 0.406: IC3.13 arc45 100.52,31.56 99.51,32.57 arc45 98.42,33.02 98.21,33.02 arc-45 96.41,33.76 R24.1 94.72,35.45 arc45 92.93,36.2 86.9,36.2 arc45 85.98,35.81 | R20.2 R22.1 85.98,35.81 | 85.98,35.81 arc45 85.98,35.81
N$21
  Bottom 0.406: R21.1 88.9,34.29 arc-45 89.98,33.84 90.81,33.02 arc45 92.34,32.38 95.47,32.38 arc-45 97.26,31.64 IC3.14
N$22
  Bottom 0.406: IC4.1 120.76,21.06 arc-45 118.96,20.32 R29.1
N$23
  Bottom 0.406: R17.2 57.04,31.22 arc45 58.84,30.48 IC1.16
N$24
  Bottom 0.406: IC3.16 89.32,30.48 arc-45 87.52,31.22 R23.2
N$25
  Bottom 0.406: IC4.5 R28.1 126.47,16.62 arc-45 124.68,15.88 115.83,15.88 arc45 114.3,15.24 113.77,14.71 arc45 113.03,12.92 113.03,11.21 arc45 113.77,9.42 115.12,8.07 arc-45 115.57,6.99 115.57,5.98 arc-45 114.94,4.45 114.41,3.92 arc-45 112.61,3.17 98.69,3.17 arc-45 97.16,3.81 96.63,4.34 arc45 94.83,5.08 R30.2
N$26
  Bottom 0.406: Q6.B 104.4,44.45 arc-45 102.87,45.09 arc45 101.34,45.72 101.23,45.72 | 101.23,45.72 Q5.D | R32.2 93.87,46.25 arc-45 95.67,46.99 98.16,46.99 arc-45 99.69,46.35 arc45 101.23,45.72
N$27
  Bottom 0.406: Q3.B 101.34,8.89 arc-45 102.87,8.26 arc45 104.4,7.62 Q2.D 104.99,7.62 arc-45 106.79,6.88 107.31,6.35 arc45 108.85,5.71 R31.2
N$28
  Bottom 0.406: C8.1 123.93,43.29 arc-45 122.14,42.55 119.64,42.55 arc-45 118.11,43.18 arc-45 117.47,44.71 S1.2
N$29
  Bottom 0.406: C8.2 126.58,39.37 arc45 128.38,40.11 R33.1
N$30
  Bottom 0.406: IC4.14 127.64,31.97 arc-45 128.38,33.76 R35.2 R33.2 133.88,35.45 arc-45 135.67,36.2 137.53,36.2 arc-45 139.06,35.56 139.59,35.03 arc45 141.39,34.29 R34.1
N$31
  Bottom 0.406: IC4.12 arc-45 133.16,31.56 133.35,31.75 arc-45 134.88,32.38 143.88,32.38 arc45 145.41,33.02 arc45 146.05,34.55 146.05,35.14 arc-45 146.79,36.94 148.48,38.63 arc-45 150.28,39.37 | 150.28,39.37 C9.1 157.37,37.57 arc-45 158.12,35.78 158.12,35.34 arc-45 157.37,33.55 IC2.6 | R37.1 151.76,41.91 arc-45 151.02,40.11 150.28,39.37
N$32
  Bottom 0.406: 125.31,41.91 arc45 127.11,42.65 R35.1 | 123.86,41.31 arc-45 125.31,41.91 | VR2.S 117.47,36.41 arc-45 118.22,38.21 119.57,39.56 arc-45 120.65,40.01 121.5,40.01 arc45 123.3,40.75 123.86,41.31 | 125.31,41.91 arc45 123.86,41.31
N$33
  Bottom 0.406: IC4.16 123.72,29.32 arc45 125.51,28.57 138.65,28.57 arc-45 140.44,27.83 141.79,26.48 arc-45 142.24,25.4 142.24,22.64 arc-45 141.5,20.85 140.44,19.79 arc-45 138.65,19.05 R36.1
N$34
  Bottom 0.406: R2.1 56.52,17.78 arc-45 54.98,17.14 53.98,17.14 arc-45 52.89,17.59 52.52,17.97 arc-45 52.07,19.05 arc45 51.62,20.13 50.91,20.85 arc-45 50.16,22.64 50.16,24.5 arc45 49.53,26.04 arc45 48,26.67 VR1.S
N$35
  Bottom 0.406: C9.2 R37.2 | R37.2 IC2.7 | R37.2 R38.1
N$36
  Bottom 0.406: C10.+ 142.84,37.85 arc45 144.63,38.59 147.21,41.17 arc45 147.96,42.96 R38.2
N$37
  Bottom 0.406: C11.+ R1.2
N$38
  Bottom 0.406: IC5.1 25.82,22.86 arc45 24.02,22.12 R42.2 19.16,17.25 arc-45 17.36,16.51 16.29,16.51 arc45 14.5,15.77 VR3.A
N$39
  Bottom 0.406: VR3.S VR3.E 16.06,12.25 arc-45 17.14,12.7 17.36,12.7 arc45 19.16,13.44 R39.1
N$40
  Bottom 0.406: R39.2 27.2,11.32 arc-45 28.99,12.06 32.12,12.06 arc-45 33.66,11.43 34.18,10.9 arc45 35.98,10.16 R40.1 42.13,10.16 arc45 43.92,10.9 44.45,11.43 arc45 45.09,12.96 Q8.B
N$41
  Bottom 0.406: IC5.3 31.11,21.37 arc45 31.86,19.58 R43.1
N$42
  Bottom 0.406: IC5.2 R48.2 28.57,17.56 arc-45 27.83,15.77 R42.1 17.89,5.82 arc-45 16.09,5.08 R47.2
N$43
  Bottom 0.406: Q7.B 40.86,15.24 arc45 42.65,15.98 Q8.E arc-45 44.71,17.14 45.3,17.14 arc-45 47.1,16.4 49.42,14.08 arc-45 50.16,12.28 R41.1
N$44
  Bottom 0.406: R46.2 45.61,37.57 | 45.61,37.57 arc-45 46.35,35.78 VR4.S | VR4.E 48.68,35.56 arc-45 46.88,36.3 45.61,37.57
N$45
  Bottom 0.406: VR5.S VR5.E 127.85,12.7 arc-45 129.65,11.96 132.61,9 arc-45 133.35,7.2 R51.2
N$46
  Bottom 0.406: R46.1 38.73,36.41 arc45 37.99,38.21 36.3,39.9 arc45 34.51,40.64 30.06,40.64 | R45.2 27.83,41.38 arc45 29.63,40.64 30.06,40.64 | Q9.E 33.02,38.1 arc45 32.57,39.18 31.86,39.9 arc45 30.06,40.64
N$47
  Bottom 0.406: Q9.B 32.01,36.2 arc-45 30.48,36.83 arc45 28.95,37.47 21.22,37.47 arc45 19.68,36.83 18.86,36.01 arc45 18.41,34.92 18.41,34.55 arc45 19.05,33.02 arc45 20.58,32.38 25.62,32.38 arc-45 27.41,31.64 IC5.7
N$48
  Bottom 0.406: R44.2 R52.2 | R52.2 arc-45 29.66,33.84 30.37,33.13 arc-45 31.11,31.33 IC5.6 | R45.1 R52.2
N$49
  Bottom 0.406: R50.2 146.16,11.96 arc45 144.36,12.7 Q10.E 141.6,8.67 arc45 142.35,6.88 R51.1
N$50
  Bottom 0.406: Q10.B 141.34,13.97 arc45 142.88,14.61 arc45 143.51,16.14 143.51,18.63 arc-45 144.25,20.43 144.78,20.95 arc-45 146.31,21.59 147.32,21.59 arc45 148.4,22.04 IC2.1
N$51
  Bottom 0.406: R47.1 25.29,4.55 arc45 27.09,3.81 J2.1
N$52
  Bottom 0.406: 151.76,19.05 R50.1 R53.2 | 151.76,19.05 R49.2 | IC2.2 151.76,19.05
N$53
  Bottom 0.406: R49.1 150.6,6.46 arc45 149.86,4.66 J4.1
N$54
  Bottom 0.406: R48.1 29.74,7.73 arc45 31.53,6.99 36.57,6.99 arc-45 38.1,6.35 arc-45 38.73,4.82 VR6.S
N$55
  Bottom 0.406: J5.1 51.65,3.81 arc45 53.45,4.55 R1.1
N$56
  Bottom 0.406: R44.1 22.75,46.25 arc-45 24.55,46.99 30.06,46.99 arc-45 31.86,46.25 J3.1
N$57
  Bottom 0.406: C10.- J6.1
N$58
  Bottom 0.406: R52.1 28.95,44.45 arc-45 30.48,43.81 31.01,43.29 arc45 32.8,42.55 34.29,42.55 arc45 35.37,42.99 40.53,48.15 arc-45 42.33,48.9 44.19,48.9 arc-45 45.72,48.26 arc-45 46.35,46.73 VR7.S
N$59  (via drill 3 pad 5)
  other vias: 3.81,3.81
N$60
  Bottom 0.406: R53.1 145.41,4.71 arc-45 144.78,3.17 arc-45 143.25,2.54 134.25,2.54 arc-45 132.72,3.17 132.53,3.36 arc-45 132.08,4.45 arc45 131.63,5.53 131.44,5.71 arc45 129.91,6.35 129.54,6.35 arc45 128.46,5.9 128.27,5.71 arc45 127.64,4.18 VR8.S
N$61  (via drill 3 pad 5)
  other vias: 156.21,3.81
N$62  (via drill 3 pad 5)
  other vias: 156.21,45.72
N$63
  Top 2.032: J1.1 8.88,37.06 arc-45 10.68,36.31 L1.1
N$64
  Top 2.032: J1.4 8.88,25.17 arc45 10.68,25.91 L2.1

### Text on the board
tValues: RES | FREQ | AMP
tDocu: ACMS Spring 2020 / tuwuhs, Apr '20 | KENOBI (based on OB-1) / 4-pole VCF and VCA | GND | GND | +15 | GND | -15 | GND | GND | GND